# Altium schematic sheet beweging.SchDoc
size A4; SheetNumber: 4; SheetTotal: 10
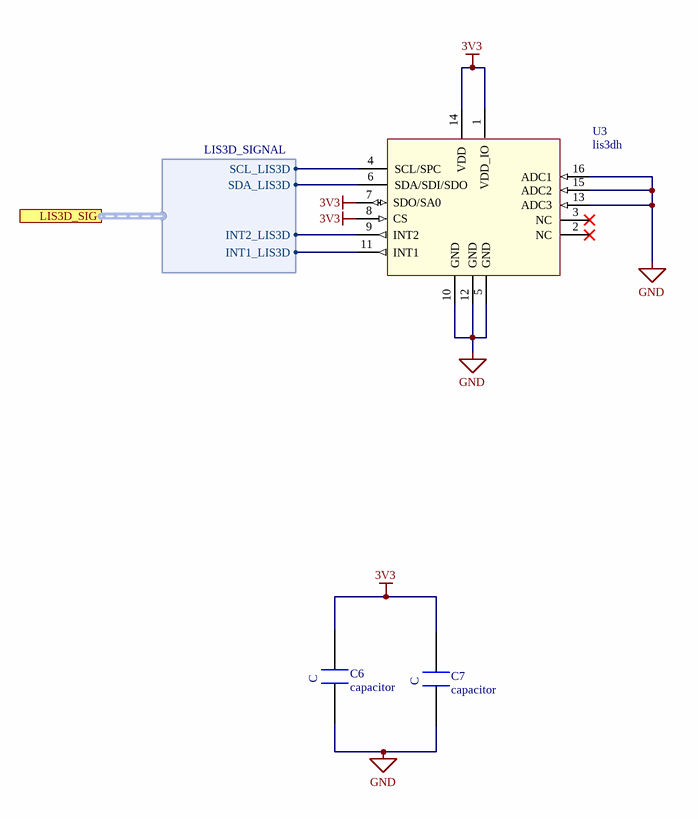
[diagram p0: beweging.SchDoc]

## Parts
C6  capacitor  [0603]
C7  capacitor  [0603]
U3  lis3dh

## Ports
LIS3D_SIG (harness LIS3D_SIGNAL)

## Harnesses
LIS3D_SIGNAL: SCL_LIS3D, SDA_LIS3D, INT2_LIS3D, INT1_LIS3D

## Nets
3V3: C6.1 C7.1 U3.1(VDD_IO) U3.7(SDO/SA0) U3.8(CS) U3.14(VDD)
GND: C6.2 C7.2 U3.5(GND) U3.10(GND) U3.12(GND) U3.13(ADC3) U3.15(ADC2) U3.16(ADC1)
NetU3_4: U3.4(SCL/SPC) ; port LIS3D_SIG.SCL_LIS3D
NetU3_6: U3.6(SDA/SDI/SDO) ; port LIS3D_SIG.SDA_LIS3D
NetU3_9: U3.9(INT2) ; port LIS3D_SIG.INT2_LIS3D
NetU3_11: U3.11(INT1) ; port LIS3D_SIG.INT1_LIS3D

Not connected (* = marked no-connect by the designer): U3 2(NC)* 3(NC)*

## Notes on the sheet
- (in symbol capacitor) C

## Library data of the parts
U3 = lis3dh: low power accelerometer from st micro